# Altium project PCB_PowerBtn.PrjPcb
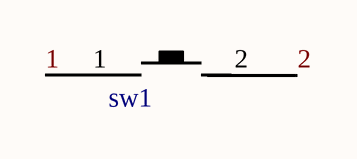
[diagram p0: PCB_PowerBtn.SchDoc]
1 sheet, 1 parts. Net scope: global (net labels, ports and power ports of the same name join across sheets).
Board file: PCB_PowerBtn.PcbDoc

## Sheet PCB_PowerBtn.SchDoc
size A

### Parts
sw1  tactile_switch_power  [tactile_switch_power]  (value not drawn)

### Nets
1: sw1.1
2: sw1.2